# EAGLE design 44TQFP (EAGLE 6.0)
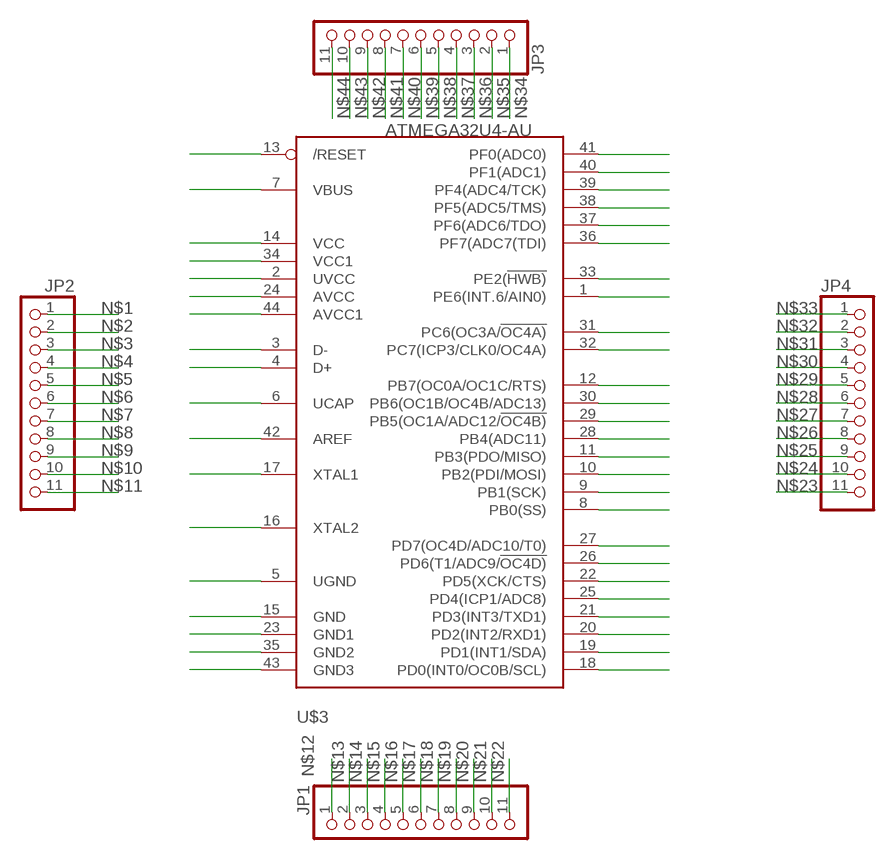
[diagram p0: schematic, sheet 1]

## Parts
JP1  PINHD-1X11  [1X11]
JP2  PINHD-1X11  [1X11]
JP3  PINHD-1X11  [1X11]
JP4  PINHD-1X11  [1X11]
U$3  ATMEGA32U4-AU  [TQFP44]

## Nets
N$1: JP2.1 U$3.1(PE6(INT.6/AIN0))
N$2: JP2.2 U$3.2(UVCC)
N$3: JP2.3 U$3.3(D-)
N$4: JP2.4 U$3.4(D+)
N$5: JP2.5 U$3.5(UGND)
N$6: JP2.6 U$3.6(UCAP)
N$7: JP2.7 U$3.7(VBUS)
N$8: JP2.8 U$3.8(PB0(SS))
N$9: JP2.9 U$3.9(PB1(SCK))
N$10: JP2.10 U$3.10(PB2(PDI/MOSI))
N$11: JP2.11 U$3.11(PB3(PDO/MISO))
N$12: JP1.1 U$3.12(PB7(OC0A/OC1C/RTS))
N$13: JP1.2 U$3.13(/RESET)
N$14: JP1.3 U$3.14(VCC)
N$15: JP1.4 U$3.15(GND)
N$16: JP1.5 U$3.16(XTAL2)
N$17: JP1.6 U$3.17(XTAL1)
N$18: JP1.7 U$3.18(PD0(INT0/OC0B/SCL))
N$19: JP1.8 U$3.19(PD1(INT1/SDA))
N$20: JP1.9 U$3.20(PD2(INT2/RXD1))
N$21: JP1.10 U$3.21(PD3(INT3/TXD1))
N$22: JP1.11 U$3.22(PD5(XCK/CTS))
N$23: JP4.11 U$3.23(GND1)
N$24: JP4.10 U$3.24(AVCC)
N$25: JP4.9 U$3.25(PD4(ICP1/ADC8))
N$26: JP4.8 U$3.26(PD6(T1/ADC9/!OC4D))
N$27: JP4.7 U$3.27(PD7(OC4D/ADC10/T0))
N$28: JP4.6 U$3.28(PB4(ADC11))
N$29: JP4.5 U$3.29(PB5(OC1A/ADC12/!OC4B))
N$30: JP4.4 U$3.30(PB6(OC1B/OC4B/ADC13))
N$31: JP4.3 U$3.31(PC6(OC3A/!OC4A))
N$32: JP4.2 U$3.32(PC7(ICP3/CLK0/OC4A))
N$33: JP4.1 U$3.33(PE2(!HWB))
N$34: JP3.1 U$3.34(VCC1)
N$35: JP3.2 U$3.35(GND2)
N$36: JP3.3 U$3.36(PF7(ADC7(TDI))
N$37: JP3.4 U$3.37(PF6(ADC6/TDO))
N$38: JP3.5 U$3.38(PF5(ADC5/TMS))
N$39: JP3.6 U$3.39(PF4(ADC4/TCK))
N$40: JP3.7 U$3.40(PF1(ADC1))
N$41: JP3.8 U$3.41(PF0(ADC0))
N$42: JP3.9 U$3.42(AREF)
N$43: JP3.10 U$3.43(GND3)
N$44: JP3.11 U$3.44(AVCC1)

## Library data of the parts
JP1-JP4 = pinhead:PINHD-1X11: PIN HEADER
U$3 = adafruit:ATMEGA32U4: http://www.ladyada.net/library/eagle

## Board
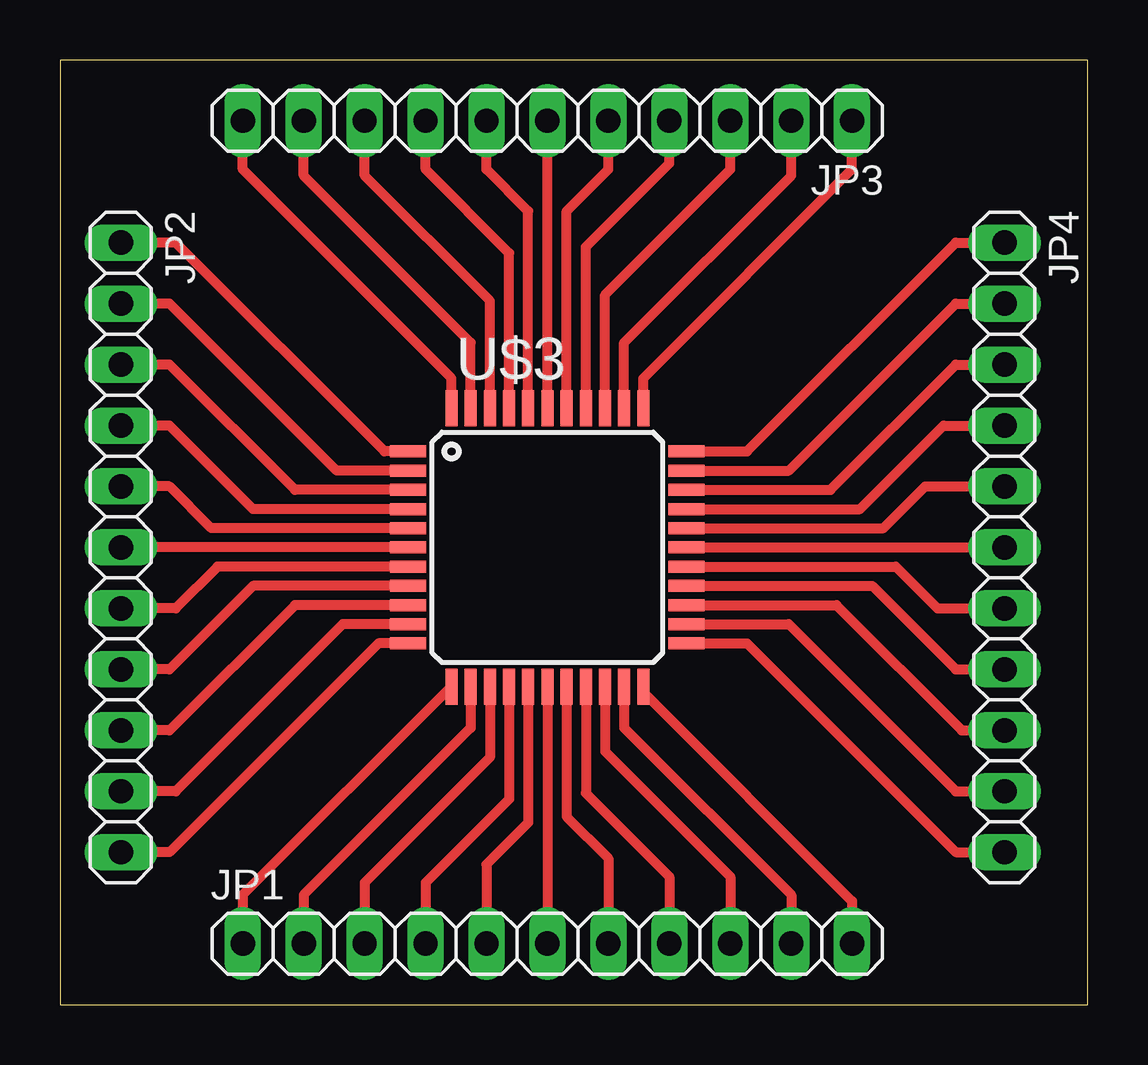
[diagram p1: board, top side]

Size 42.85 x 39.36 mm. Coordinates in mm from the lower left corner, seen from the top.
Outline: 0,0 42.85,0 42.85,39.36 0,39.36 0,0
Copper layers (1*16): Top 0.035mm / dielectric 1.5mm / Bottom 0.035mm
Design rules: minimum track width 10mil, minimum drill 24mil, track to track 8mil, track to pad 8mil, pad to pad 8mil, via to via 8mil, smd to smd 8mil, copper to edge 40mil, drill to drill 8mil, minimum pad ring 10mil, minimum via ring 8mil, stop-mask expansion 4mil, vias tented up to drill 0mil, thermal gap 10mil

### Footprints (pad centres in the part's own frame; a part is rotated, then mirrored left to right if it is on the bottom)
1X11 = drill 1.016 long: 1 -12.7,0; 2 -10.16,0; 3 -7.62,0; 4 -5.08,0; 5 -2.54,0; 6 0,0; 7 2.54,0; 8 5.08,0; 9 7.62,0; 10 10.16,0; 11 12.7,0
TQFP44 = smd 1.5 x 0.5: 1 -5.8,4; 2 -5.8,3.2; 3 -5.8,2.4; 4 -5.8,1.6; 5 -5.8,0.8; 6 -5.8,0; 7 -5.8,-0.8; 8 -5.8,-1.6; 9 -5.8,-2.4; 10 -5.8,-3.2; 11 -5.8,-4; 23 5.8,-4; 24 5.8,-3.2; 25 5.8,-2.4; 26 5.8,-1.6; 27 5.8,-0.8; 28 5.8,0; 29 5.8,0.8; 30 5.8,1.6; 31 5.8,2.4; 32 5.8,3.2; 33 5.8,4 | smd 0.5 x 1.5: 12 -4,-5.8; 13 -3.2,-5.8; 14 -2.4,-5.8; 15 -1.6,-5.8; 16 -0.8,-5.8; 17 0,-5.8; 18 0.8,-5.8; 19 1.6,-5.8; 20 2.4,-5.8; 21 3.2,-5.8; 22 4,-5.8; 34 4,5.8; 35 3.2,5.8; 36 2.4,5.8; 37 1.6,5.8; 38 0.8,5.8; 39 0,5.8; 40 -0.8,5.8; 41 -1.6,5.8; 42 -2.4,5.8; 43 -3.2,5.8; 44 -4,5.8

### Placement (x,y rotation side)
JP1  20.32,2.54 0 top
JP2  2.54,19.05 270 top
JP3  20.32,36.83 180 top
JP4  39.37,19.05 270 top
U$3  20.32,19.05 0 top

### Tracks (layer width: path | path; a pad name or v marks a point on that pad's centre or on a via)
N$1
  Top 0.406: U$3.1 13.53,23.05 4.83,31.75 JP2.1
N$2
  Top 0.406: U$3.2 11.53,22.25 4.57,29.21 JP2.2
N$3
  Top 0.406: U$3.3 9.79,21.45 4.57,26.67 JP2.3
N$4
  Top 0.406: U$3.4 8.05,20.65 4.57,24.13 JP2.4
N$5
  Top 0.406: U$3.5 6.31,19.85 4.57,21.59 JP2.5
N$6
  Top 0.406: U$3.6 JP2.6
N$7
  Top 0.406: U$3.7 6.57,18.25 4.83,16.51 JP2.7
N$8
  Top 0.406: U$3.8 8.05,17.45 4.57,13.97 JP2.8
N$9
  Top 0.406: U$3.9 9.79,16.65 4.57,11.43 JP2.9
N$10
  Top 0.406: U$3.10 11.79,15.85 4.83,8.89 JP2.10
N$11
  Top 0.406: U$3.11 13.27,15.05 4.57,6.35 JP2.11
N$12
  Top 0.406: U$3.12 16.3,13.25 7.62,4.57 JP1.1
N$13
  Top 0.406: U$3.13 17.12,11.53 10.16,4.57 JP1.2
N$14
  Top 0.406: U$3.14 17.92,10.3 12.7,5.08 JP1.3
N$15
  Top 0.406: U$3.15 18.72,8.56 15.24,5.08 JP1.4
N$16
  Top 0.406: U$3.16 19.52,7.58 17.78,5.84 JP1.5
N$17
  Top 0.406: U$3.17 JP1.6
N$18
  Top 0.406: U$3.18 21.12,7.84 22.86,6.1 JP1.7
N$19
  Top 0.406: U$3.19 21.92,8.81 25.4,5.33 JP1.8
N$20
  Top 0.406: U$3.20 22.72,10.55 27.94,5.33 JP1.9
N$21
  Top 0.406: U$3.21 23.52,11.53 30.48,4.57 JP1.10
N$22
  Top 0.406: U$3.22 24.32,13.02 33.02,4.32 JP1.11
N$23
  Top 0.406: U$3.23 28.64,15.05 37.34,6.35 JP4.11
N$24
  Top 0.406: U$3.24 30.38,15.85 37.34,8.89 JP4.10
N$25
  Top 0.406: U$3.25 32.37,16.65 37.59,11.43 JP4.9
N$26
  Top 0.406: U$3.26 33.86,17.45 37.34,13.97 JP4.8
N$27
  Top 0.406: U$3.27 34.84,18.25 36.58,16.51 JP4.7
N$28
  Top 0.406: U$3.28 JP4.6
N$29
  Top 0.406: U$3.29 34.33,19.85 36.07,21.59 JP4.5
N$30
  Top 0.406: U$3.30 33.35,20.65 36.83,24.13 JP4.4
N$31
  Top 0.406: U$3.31 32.12,21.45 37.34,26.67 JP4.3
N$32
  Top 0.406: U$3.32 30.38,22.25 37.34,29.21 JP4.2
N$33
  Top 0.406: U$3.33 28.64,23.05 37.34,31.75 JP4.1
N$34
  Top 0.406: U$3.34 24.32,26.1 33.02,34.8 JP3.1
N$35
  Top 0.406: U$3.35 23.52,27.58 30.48,34.54 JP3.2
N$36
  Top 0.406: U$3.36 22.72,29.58 27.94,34.8 JP3.3
N$37
  Top 0.406: U$3.37 21.92,31.57 25.4,35.05 JP3.4
N$38
  Top 0.406: U$3.38 21.12,33.06 22.86,34.8 JP3.5
N$39
  Top 0.406: U$3.39 JP3.6
N$40
  Top 0.406: U$3.40 19.52,33.06 17.78,34.8 JP3.7
N$41
  Top 0.406: U$3.41 18.72,31.32 15.24,34.8 JP3.8
N$42
  Top 0.406: U$3.42 17.92,29.32 12.7,34.54 JP3.9
N$43
  Top 0.406: U$3.43 17.12,27.58 10.16,34.54 JP3.10
N$44
  Top 0.406: U$3.44 16.32,26.1 7.62,34.8 JP3.11